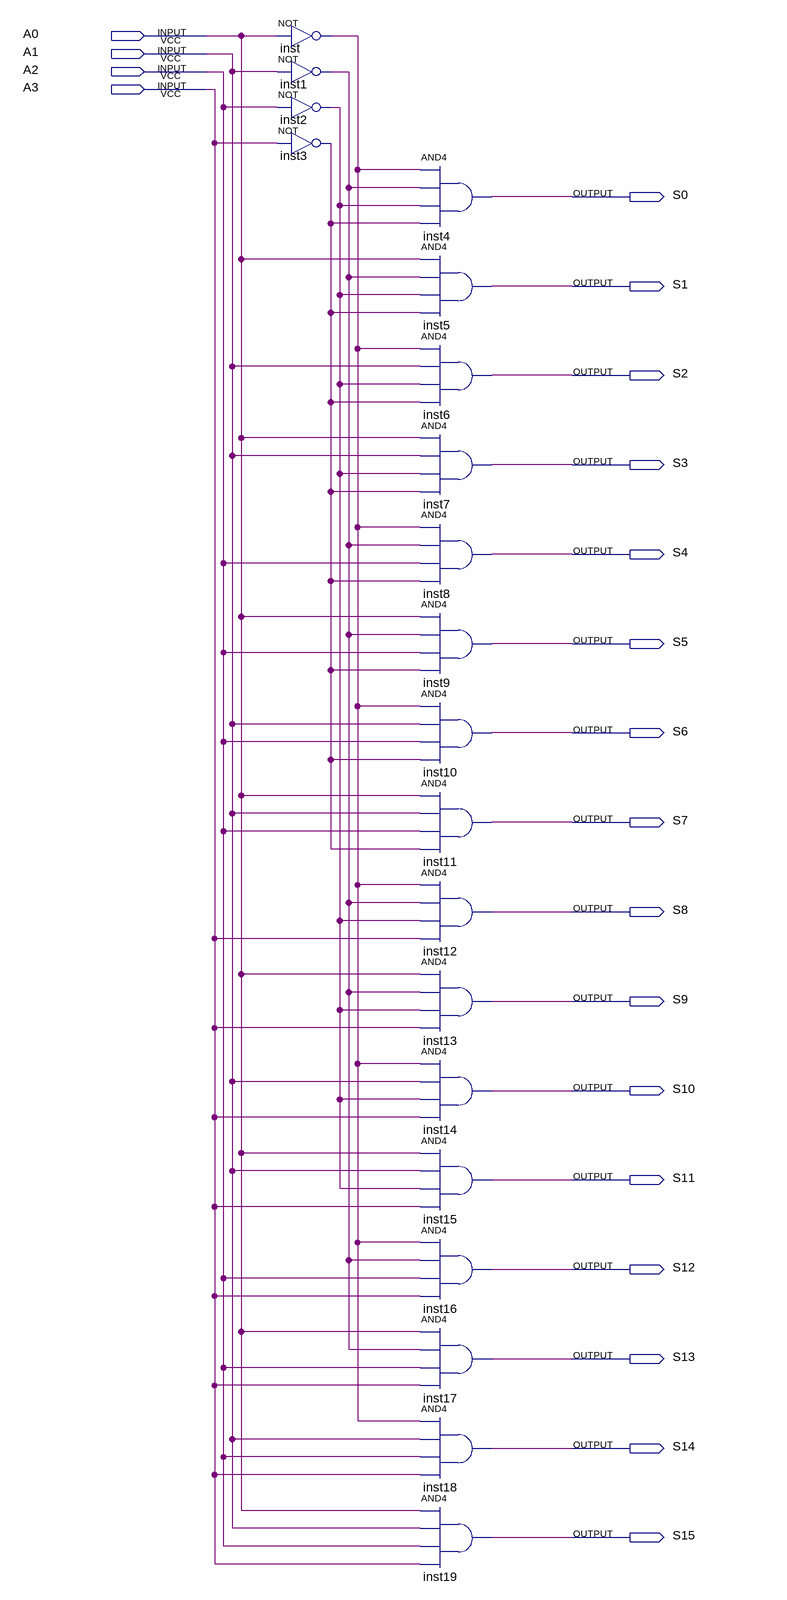
[diagram p0: schematic sheet]
// Quartus schematic decodificador_4x16.bdf as structural Verilog: 20 symbols, 20 pins
module decodificador_4x16 (
  input  A0,
  input  A1,
  input  A2,
  input  A3,
  output S0,
  output S1,
  output S2,
  output S3,
  output S4,
  output S5,
  output S6,
  output S7,
  output S8,
  output S9,
  output S10,
  output S11,
  output S12,
  output S13,
  output S14,
  output S15
);

  wire inst1_out, inst2_out, inst3_out, inst_out;

  not inst (inst_out, A0);
  not inst1 (inst1_out, A1);
  not inst2 (inst2_out, A2);
  not inst3 (inst3_out, A3);
  and inst4 (S0, inst_out, inst1_out, inst2_out, inst3_out);
  and inst5 (S1, A0, inst1_out, inst2_out, inst3_out);
  and inst6 (S2, inst_out, A1, inst2_out, inst3_out);
  and inst7 (S3, A0, A1, inst2_out, inst3_out);
  and inst8 (S4, inst_out, inst1_out, A2, inst3_out);
  and inst9 (S5, A0, inst1_out, A2, inst3_out);
  and inst10 (S6, inst_out, A1, A2, inst3_out);
  and inst11 (S7, A0, A1, A2, inst3_out);
  and inst12 (S8, inst_out, inst1_out, inst2_out, A3);
  and inst13 (S9, A0, inst1_out, inst2_out, A3);
  and inst14 (S10, inst_out, A1, inst2_out, A3);
  and inst15 (S11, A0, A1, inst2_out, A3);
  and inst16 (S12, inst_out, inst1_out, A2, A3);
  and inst17 (S13, A0, inst1_out, A2, A3);
  and inst18 (S14, inst_out, A1, A2, A3);
  and inst19 (S15, A0, A1, A2, A3);
endmodule
